# Altium schematic sheet Control_Module_CPU.SchDoc: Módulo de Control - CPU Principal
size A4; Author: Martin C.A. Yunis; CompanyName: Sistema de Control de Acceso; Revision: V1; SheetNumber: 3; SheetTotal: 7
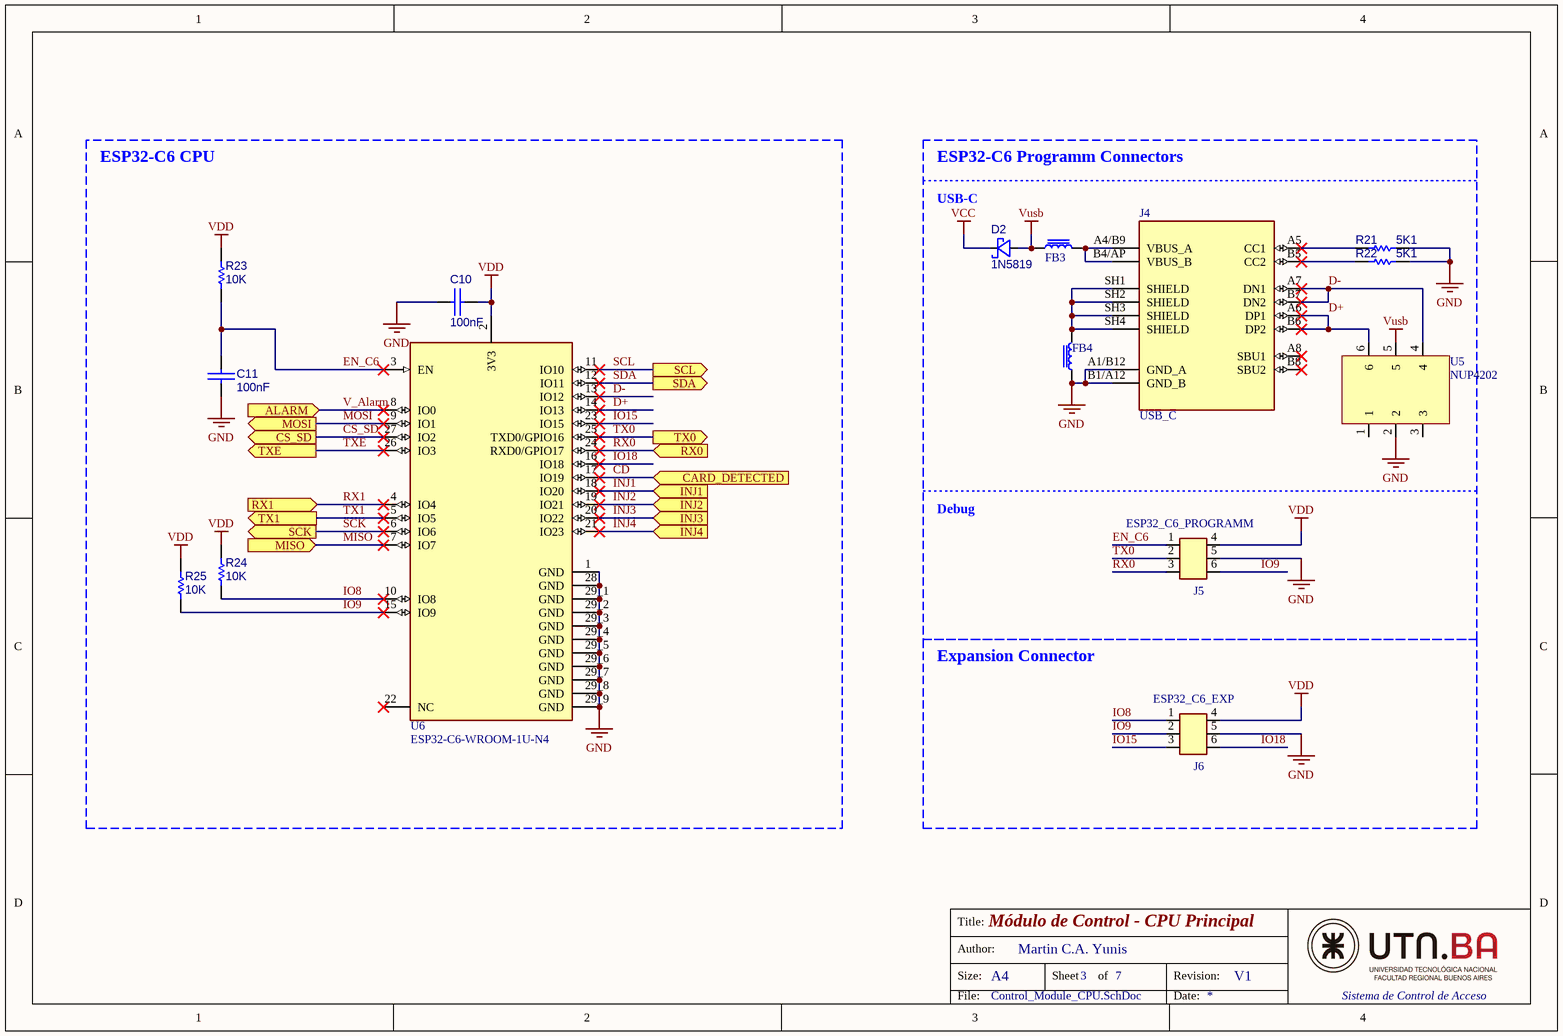
[diagram p0: Control_Module_CPU.SchDoc]

## Parts
C10  100nF  [CAP0402]
C11  100nF  [CAP0402]
D2  1N5819  [SOD_123]
FB3  Choke  [CHOKE0603]  (value not drawn)
FB4  Choke  [CHOKE0603]  (value not drawn)
J4  USB_C  [TE_2340901-1]
J5  ESP32_C6_PROGRAMM  [SAMTEC_MTSW-103-X-X-D-X]
J6  ESP32_C6_EXP  [SAMTEC_MTSW-103-X-X-D-X]
R21  5K1  [RES0402]
R22  5K1  [RES0402]
R23  10K  [RES0402]
R24  10K  [RES0402]
R25  10K  [RES0402]
U5  NUP4202  [SOT65P210X110-6N]
U6  ESP32-C6-WROOM-1U-N4  [XCVR_ESP32-C6-WROOM-1-N8]

## Blocks framed on the sheet
ESP32-C6 CPU: C10 C11 R23-R25 U6
ESP32-C6 Programm Connectors: D2 FB3 FB4 J4 J5 R21 R22 U5
Expansion Connector: J6

## Ports
ALARM (in, see Control_Module_MAIN[3A], Control_Module_IO[2B]), CARD_DETECTED (in, see Control_Module_MAIN[2C], Control_Module_PER[2B]), CS_SD (out, see Control_Module_MAIN[2C], Control_Module_PER[3B]), INJ1 (in, see Control_Module_MAIN[3C], Control_Module_RS485[1C]), INJ2 (in, see Control_Module_MAIN[3C], Control_Module_RS485[2C]), INJ3 (in, see Control_Module_MAIN[3C], Control_Module_RS485[1C]), INJ4 (in, see Control_Module_MAIN[3C], Control_Module_RS485[2C]), MISO (in, see Control_Module_MAIN[2B], Control_Module_PER[3B]), MOSI (out, see Control_Module_MAIN[2C], Control_Module_PER[3B]), RX0 (in, see Control_Module_MAIN[3B], Control_Module_RS485[1A]), RX1 (in, see Control_Module_MAIN[2B], Control_Module_ETH[2B]), SCK (out, see Control_Module_MAIN[2B], Control_Module_PER[3B]), SCL (out, see Control_Module_MAIN[2C], Control_Module_PER[2C]), SDA (out, see Control_Module_MAIN[2C], Control_Module_PER[2C]), TX0 (out, see Control_Module_MAIN[3B], Control_Module_RS485[1B]), TX1 (out, see Control_Module_MAIN[2A], Control_Module_ETH[2B]), TXE (out, see Control_Module_MAIN[3B], Control_Module_RS485[1B])

## Nets
GND: C10.1 C11.2 FB4.1 J4.A1/B12(GND_A) J4.B1/A12(GND_B) J5.5 J6.5 R21.2 R22.2 U5.2 U6.1(GND) U6.28(GND) U6.29_1(GND) U6.29_2(GND) U6.29_3(GND) U6.29_4(GND) U6.29_5(GND) U6.29_6(GND) U6.29_7(GND) U6.29_8(GND) U6.29_9(GND)
VCC: D2.2(K)
VDD: C10.2 J5.4 J6.4 R23.1 R24.1 R25.1 U6.2(3V3)
Vusb: D2.1(A) FB3.1 U5.5
CD: U6.17(IO19) ; port CARD_DETECTED
CS_SD: U6.27(IO2) ; port CS_SD
D+: J4.A6(DP1) J4.B6(DP2) U5.6 U6.14(IO13)
D-: J4.A7(DN1) J4.B7(DN2) U5.4 U6.13(IO12)
EN_C6: C11.1 J5.1 R23.2 U6.3(EN)
INJ1: U6.18(IO20) ; port INJ1
INJ2: U6.19(IO21) ; port INJ2
INJ3: U6.20(IO22) ; port INJ3
INJ4: U6.21(IO23) ; port INJ4
IO8: J6.1 R24.2 U6.10(IO8)
IO9: J5.6 J6.2 R25.2 U6.15(IO9)
IO15: J6.3 U6.23(IO15)
IO18: J6.6 U6.16(IO18)
MISO: U6.7(IO7) ; port MISO
MOSI: U6.9(IO1) ; port MOSI
RX0: J5.3 U6.24(RXD0/GPIO17) ; port RX0
RX1: U6.4(IO4) ; port RX1
SCK: U6.6(IO6) ; port SCK
SCL: U6.11(IO10) ; port SCL
SDA: U6.12(IO11) ; port SDA
TX0: J5.2 U6.25(TXD0/GPIO16) ; port TX0
TX1: U6.5(IO5) ; port TX1
TXE: U6.26(IO3) ; port TXE
V_Alarm: U6.8(IO0) ; port ALARM
NetFB3_2: FB3.2 J4.A4/B9(VBUS_A) J4.B4/AP(VBUS_B)
NetFB4_2: FB4.2 J4.SH1(SHIELD) J4.SH2(SHIELD) J4.SH3(SHIELD) J4.SH4(SHIELD)
NetJ4_A5: J4.A5(CC1) R21.1
NetJ4_B5: J4.B5(CC2) R22.1

Not connected (* = marked no-connect by the designer): J4 A8(SBU1)* B8(SBU2)*; U5 1 3; U6 22(NC)*

## Notes on the sheet
- (near D2) USB-C
- Debug
- Title:
- Size:
- Author:
- A4
- Sheet
- of
- Revision:
- File:
- Date:

## Library data of the parts
C10 C11 = CAP: Non Polarized Capacitor; MANUF P/N: CL05B104KO5NNNC; JLCPCB P/N: C1525
D2 = DIODO_SH: Diode Shottky; MANUF P/N: 1N5819HW-7-F; JLCPCB P/N: C82544
FB3 FB4 = Choke: High Frequency EMI Suppression Ferrite Bead; Manufacturer Part Number: 742863160; Manufacturer: Wurth Elektronik; Match Code: WE-CBF HF; Case/Size Code: 0603; DC Resistance: 0.22Ohm; Impedance @100MHz: 600Ohm; Impedance @1GHz: 800Ohm; Impedance Max: 950Ohm; Impedance Max Test Condition: 600MHz; Rated Current: 0.5A; Type: High Current; Category: Ferrites for PCB Assembly; ComponentLink1Description: Website Link; ComponentLink1URL: https://www.we-online.com/redexpert/article/742863160?ad; ComponentLink2Description: Datasheet Link; ComponentLink2URL: https://www.we-online.com/redexpert/spec/742863160?ad; Mount: Surface Mount; Operating Temperature Max: 125°C; Operating Temperature Min: -55°C; Packaging: Tape and Reel; Length: 1.6mm; Width: 0.8mm; Height: 0.8mm
J4 = USB_C: USB Type C 2.0 Conn Rec Mid-Mount One Ro; MANUF P/N: 918-418K2024S40003; MF: TE Connectivity; MP: 2340901-1; SnapEDA_Link: https://www.snapeda.com/parts/2340901-1/TE+Connectivity/view-part/?ref=snap; Package: None; Value: *; Check_prices: https://www.snapeda.com/parts/2340901-1/TE+Connectivity/view-part/?ref=eda; JLCPCB P/N: C169130
J5 J6 = CONN_3X2P: MANUF P/N: 2.54-2*3PPin; JLCPCB P/N: C65114
R21 R22 = Res1: Resistor; MANUF P/N: CR0402JF0512G; JLCPCB P/N: C100665
R23-R25 = Res1: Resistor; MANUF P/N: CRCW040210K0FKED; JLCPCB P/N: C71617
U5 = NUP4202: 6A 20V 6V Unidirectional 5V SOT-363 ESD and Surge Protection; MANUF P/N: NUP4202W1; JLCPCB P/N: C252434
U6 = ESP32-C6-WROOM-1U-N4: 802.15.4, Bluetooth, WiFi 802.11ax, Bluetooth v5.3, ZigbeeÂ® Transceiver Module 2.4GHz Antenna Not Included, U.FL Surface Mount; MANUF P/N: ESP32-C6-WROOM-1-N8; MF: Espressif Systems; SnapEDA_Link: https://www.snapeda.com/parts/ESP32-C6-WROOM-1U-N4/Espressif+Systems/view-part/?ref=snap; Package: SMD-37 Espressif Systems; Value: *; MP: ESP32-C6-WROOM-1U-N4; Check_prices: https://www.snapeda.com/parts/ESP32-C6-WROOM-1U-N4/Espressif+Systems/view-part/?ref=eda; JLCPCB P/N: C5366877